# EAGLE design Adafuit_9DOF (EAGLE 6.5.0)
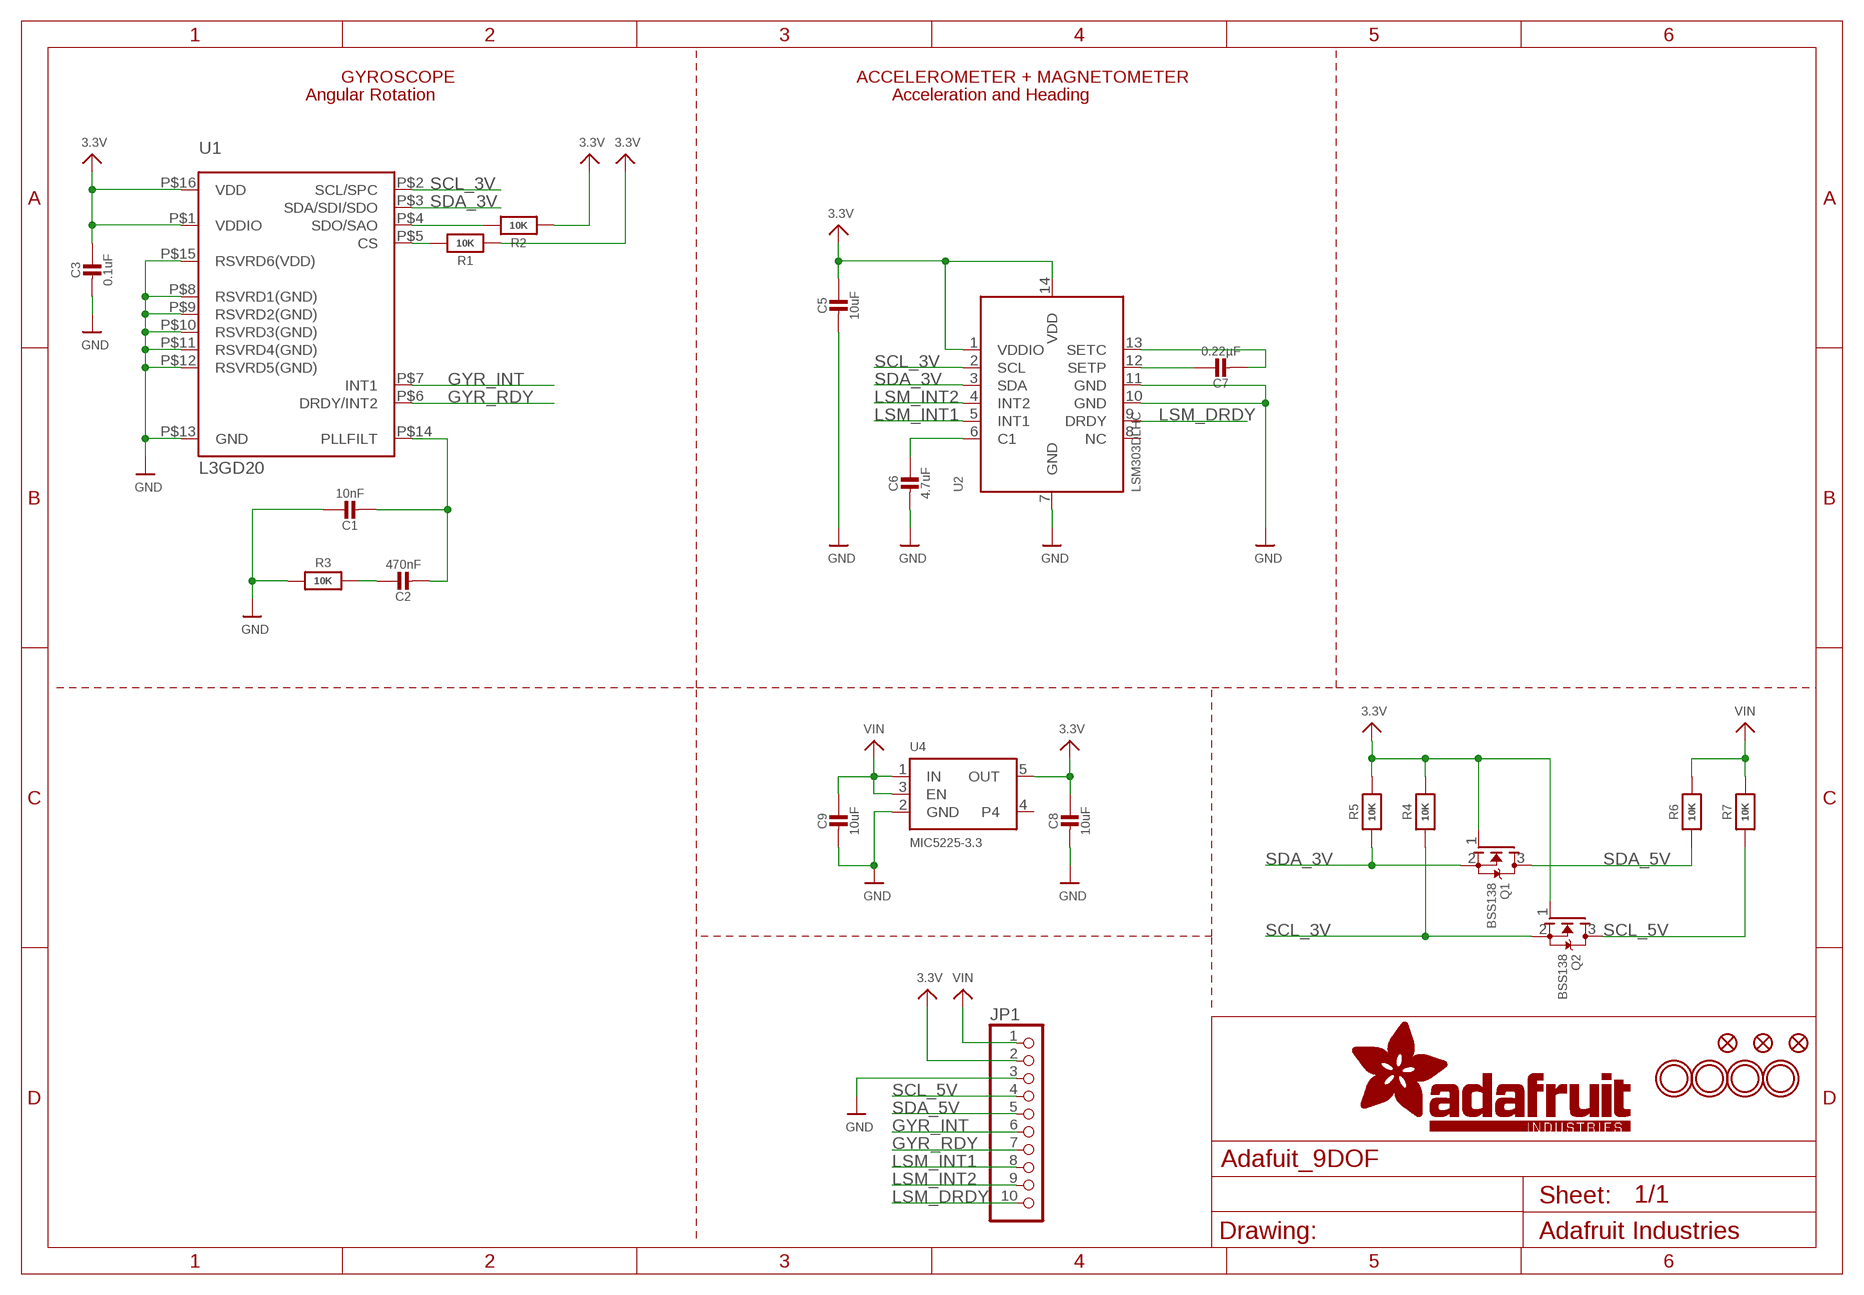
[diagram p0: schematic, sheet 1]

## Parts
C1  10nF  CAP_CERAMIC_0805MP  [_0805MP]
C2  470nF  CAP_CERAMIC_0805MP  [_0805MP]
C3  0.1uF  CAP_CERAMIC_0805MP  [_0805MP]
C5  10uF  CAP_CERAMIC_0805MP  [_0805MP]
C6  4.7uF  CAP_CERAMIC_0805MP  [_0805MP]
C7  0.22µF  CAP_CERAMIC_0805MP  [_0805MP]
C8  10uF  CAP_CERAMIC_0805MP  [_0805MP]
C9  10uF  CAP_CERAMIC_0805MP  [_0805MP]
FID1  FIDUCIAL""  [FIDUCIAL_1MM]
FID2  FIDUCIAL""  [FIDUCIAL_1MM]
FID3  FIDUCIAL""  [FIDUCIAL_1MM]
JP1  HEADER-1X10ROUND  [1X10_ROUND]
Q1  BSS138  MOSFET-NWIDE  [SOT23-WIDE]
Q2  BSS138  MOSFET-NWIDE  [SOT23-WIDE]
R1  10K  RESISTOR_0805MP  [_0805MP]
R2  10K  RESISTOR_0805MP  [_0805MP]
R3  10K  RESISTOR_0805MP  [_0805MP]
R4  10K  RESISTOR_0805MP  [_0805MP]
R5  10K  RESISTOR_0805MP  [_0805MP]
R6  10K  RESISTOR_0805MP  [_0805MP]
R7  10K  RESISTOR_0805MP  [_0805MP]
U1  L3GD20  GYRO_L3G2400D  [L3G4200D_LGA16L]
U2  LSM303DLHC  [LGA14]
U4  MIC5225-3.3  VREG_SOT23-5  [SOT23-5]
U$28  MOUNTINGHOLE2.5_THICK  [MOUNTINGHOLE_2.5_PLATED_THICK]
U$29  MOUNTINGHOLE2.5_THICK  [MOUNTINGHOLE_2.5_PLATED_THICK]
U$30  MOUNTINGHOLE2.5_THICK  [MOUNTINGHOLE_2.5_PLATED_THICK]
U$31  MOUNTINGHOLE2.5_THICK  [MOUNTINGHOLE_2.5_PLATED_THICK]

## Nets
3.3V: C3.1 C5.1 C8.1 JP1.2 Q1.1(G) Q2.1(G) R1.1 R2.1 R4.2 R5.2 U1.P$1(VDDIO) U1.P$16(VDD) U2.1(VDDIO) U2.14(VDD) U4.5(OUT)
GND: C1.1 C3.2 C5.2 C6.2 C8.2 C9.2 JP1.3 R3.1 U1.P$8(RSVRD1(GND)) U1.P$9(RSVRD2(GND)) U1.P$10(RSVRD3(GND)) U1.P$11(RSVRD4(GND)) U1.P$12(RSVRD5(GND)) U1.P$13(GND) U1.P$15(RSVRD6(VDD)) U2.7(GND) U2.10(GND) U2.11(GND) U4.2(GND)
GYR_INT: JP1.6 U1.P$7(INT1)
GYR_RDY: JP1.7 U1.P$6(DRDY/INT2)
LSM_DRDY: JP1.10 U2.9(DRDY)
LSM_INT1: JP1.8 U2.5(INT1)
LSM_INT2: JP1.9 U2.4(INT2)
N$1: R1.2 U1.P$5(CS)
N$2: R2.2 U1.P$4(SDO/SAO)
N$3: C2.1 R3.2
N$4: C1.2 C2.2 U1.P$14(PLLFILT)
N$5: C7.1 U2.12(SETP)
N$6: C6.1 U2.6(C1)
N$7: C7.2 U2.13(SETC)
SCL_3V: Q2.2(S) R4.1 U1.P$2(SCL/SPC) U2.2(SCL)
SCL_5V: JP1.4 Q2.3(D) R7.1
SDA_3V: Q1.2(S) R5.1 U1.P$3(SDA/SDI/SDO) U2.3(SDA)
SDA_5V: JP1.5 Q1.3(D) R6.1
VIN: C9.1 JP1.1 R6.2 R7.2 U4.1(IN) U4.3(EN)
Unconnected: U2.8(NC) U4.4

## Notes on the sheet
- GYROSCOPE | ACCELEROMETER + MAGNETOMETER
- Angular Rotation | Acceleration and Heading

## Library data of the parts
C1-C3 C5-C9 = microbuilder:CAP_CERAMIC: Ceramic Capacitors For new designs, use the packages preceded by an '_' character since they are more reliable: The following footprints should be used on most boards: _0402 - Standard footprint for regular board layouts _0603 - Standard footprint for regular board layouts _0805 - Standard footprint for regular board layouts _1206 - Standard footprint for regular board layouts For extremely tight-pitch boards where space is at a premium, the following 'micro-pitch' footprints can be used (smaller pads, no silkscreen outline, etc.): _0402MP - Micro-pitch footprint for very dense/compact boards _0603MP - Micro-pitch footprint for very dense/compact boards _0805MP - Micro-pitch footprint for very dense/compact boards _1206MP - Micro-pitch footprint for very dense/compact boards
FID1-FID3 = microbuilder:FIDUCIAL: Fiducial Alignment Points Various fiducial points for machine vision alignment.; BOM: EXCLUDE
JP1 = microbuilder:HEADER-1X10: PIN HEADER
Q1 Q2 = microbuilder:MOSFET-N: N-Channel Mosfet LEGEND VDS: Voltage Drain-Source ID: Drain Current RDS(ON): Drain-Source On-State Resistance VGS(TH): Gate-Source Threshold Voltage CISS: Drain-Source Input Capacitance SOT-23 Name VDS ID RDS(ON) VGS(TH) CISS Order Number 2N7002E 60V 260mA 2.5 Ohm 2.5V @ 250uA 26.7pF @ 25V 2N7002ET1GOSTR-ND BSH103 30V 850mA 400 mOhm 400mV @ 1mA 83pF @ 24V BSH103,235-ND BSS138 60V 320mA 1.6 Ohm 1.5V @ 250uA 50pF @ 10V Mouser: 771-BSS138PW115 DMN2075U-7 20V 4.2A 38 mOhm 1V @ 250 uA 594.3pF @ 10V DMN2075U-7DICT-ND * BSS138 good choice for I2C level-shifting POWERPAK 1212-8 Name VDS ID RDS(ON) VGS(TH) CISS Order Number Si7308DN 60V 6A 58 mOhm 3V @ 250uA 665pF @ 15V SI7308DN-T1-E3CT-ND
R1-R7 = microbuilder:RESISTOR: Resistors For new designs, use the packages preceded by an '_' character since they are more reliable: The following footprints should be used on most boards: _0402 - Standard footprint for regular board layouts _0603 - Standard footprint for regular board layouts _0805 - Standard footprint for regular board layouts _1206 - Standard footprint for regular board layouts For extremely tight-pitch boards where space is at a premium, the following 'micro-pitch' footprints can be used (smaller pads, no silkscreen outline, etc.): _0402MP - Micro-pitch footprint for very dense/compact boards _0603MP - Micro-pitch footprint for very dense/compact boards _0805MP - Micro-pitch footprint for very dense/compact boards _1206MP - Micro-pitch footprint for very dense/compact boards
U1 = microbuilder:GYRO_L3G2400D: L3G4200D - 3-Axis MEMS gyroscope/motion sensor Note: Same footprint works for the newer L3DG20 gyroscope Three selectable scales: 250/500/2000 dps 1²C/SPI Interface 16-bit data 8-bit temperature VDD: 2.4-3.6V (IO 1.8V compatible) -40°C-85°C
U2 = microbuilder:LSM303DLHC: LSM303DLHC 3-Axis I2C Accelerometer and 3-Axis Magnetometer VDD: 2.2-3.6V VDDIO: 1.8-VDD Magnetic Range: +/-1.3 to +/-8.1 gauss Accel Range: +/-2/4/8/16 g Temp: -40 - 85°C
U4 = microbuilder:VREG_SOT23-5: SOT23-5 Fixed Voltage Regulators Part Current Out V Out V In V Dropout θJA (°C/W) TJ (°C) Digikey Part No. ADP121 150mA 3.3V 3.4-5.5V 0.09V @ 150mA -- -- ADP121-AUJZ33R7CT-ND ADP121 150mA 3.0V 3.1-5.5V 0.09V @ 150mA -- -- ADP121-AUJZ30R7CT-ND ADP122 300mA 3.3V 3.4-5.5V 0.085V @ 300mA -- -- ADP122AUJZ-3.3-R7CT-ND ADP1712 300mA 3.3V 3.5-5.5V 0.17V @ 300mA -- -- ADP1712AUJZ-3.3-R7TR-ND AP7311 (Low Cost) 150mA 3.3V 3.5-6V 0.15V @ 150mA -- -- AP7311-33WG-7DICT-ND LD39015M18R 150mA 1.8V 1.9V-5.5V 0.08V @ 100mA -- -- 497-6977-1-ND LP2985A-33DBVR 150mA 3.3V 3.3-16V 0.28V @ 150mA 206 150 296-18479-1-ND MCP1824T-3302E/OT 300mA 3.3V 3.5V-6V 0.2V @ 300mA -- -- MCP1824T-3302E/OTCT-ND MIC5205-2.5YM5 TR 150mA 2.5V 2.7-16V 0.165V @ 150mA -- -- 576-1257-2-ND MIC5205-3.0YM5 TR 150mA 3.0V 3.2V-16V 0.165V @ 150mA -- -- 576-1258-2-ND MIC5205-3.3YM5 TR 150mA 3.3V 3.5V-16V 0.165V @ 150mA -- -- 576-1259-2-ND TPS780330220 150mA 3.3V+2.2V 3.6-5.5V 250mV Max -- -- 296-23332-1-ND TDA3663/N1,135 100mA 3.3V 3.5-45V 0.18V @ 50mA -- -- 568-5343-1-ND Max operating temp can be calculated using θJA, TJ (max junction temperature), and power in watts. Set the "Maximum Ambient Temperature" until it reaches TJ ("Max Junction Temperature"), which is the absolute limit for safe use of the regulator: Heat Sink Temperature Calculator <http://www.daycounter.com/Calculators/Heat-Sink-Temperature-Calculator.phtml> For example, With 12V source into a 3.3V LP2985 and a 30mA load, we are dissipating (12V-3.3V) * 0.03A = 0.261W. With a θJA of 206 °C/W, a TJ of 150°C, and 261mW we can safely use the chip without a heat sink up to 75°C (=147.1°C Junction Temperature).
U$28-U$31 = microbuilder:MOUNTINGHOLE: Mounting Hole For #2 screws (0.086"/2.18mm width, 0.094"/2.4mm hole) use 2.5mm; BOM: EXCLUDE

## Board
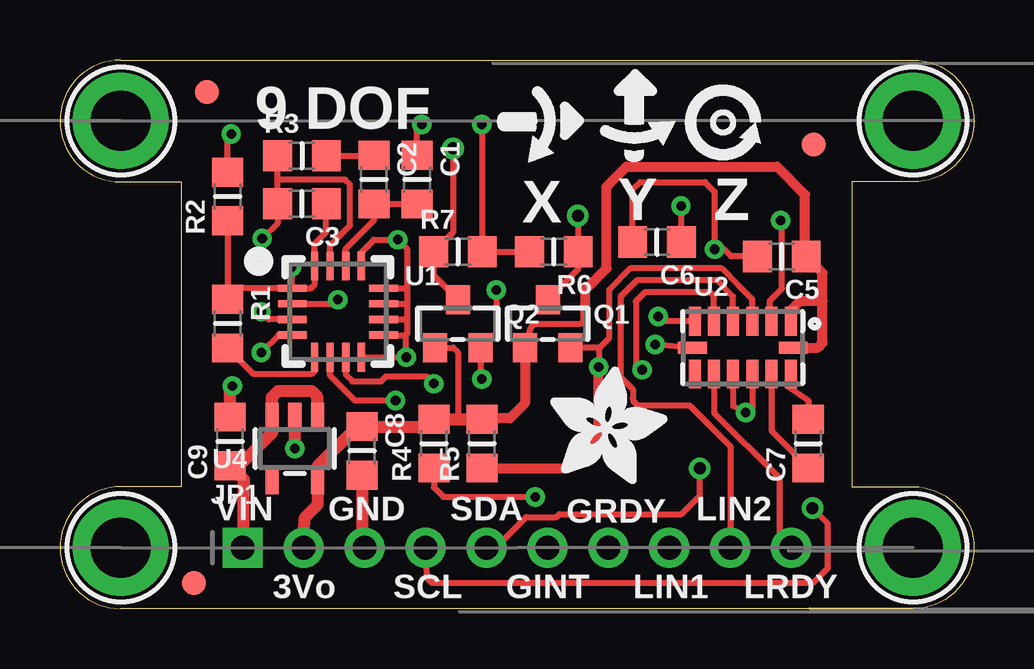
[diagram p1: board, top side]
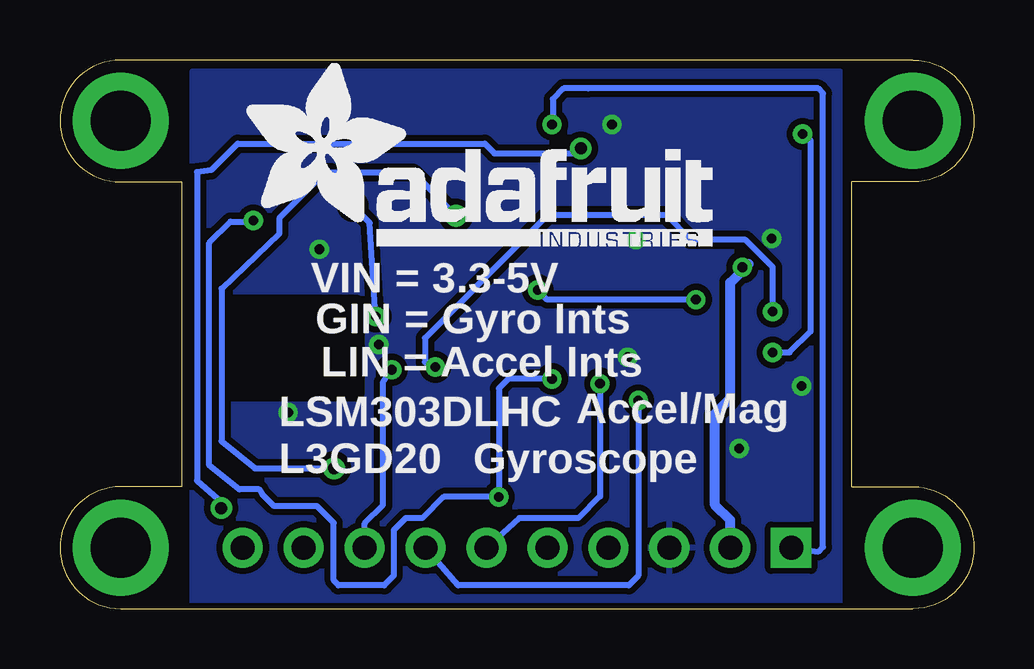
[diagram p2: board, bottom side, seen from below]

Size 38.1 x 22.86 mm. Coordinates in mm from the lower left corner, seen from the top.
Outline: 5.08,5.08 5.08,17.78 2.54,17.78 arc-90 0,20.32 arc-90 2.54,22.86 35.56,22.86 arc-90 38.1,20.32 arc-90 35.56,17.78 33.02,17.78 33.02,5.08 35.56,5.08 arc-90 38.1,2.54 arc-90 35.56,0 2.54,0 arc-90 0,2.54 arc-90 2.54,5.08 5.08,5.08
Copper layers (1*16): Top 0.035mm / dielectric 1.5mm / Bottom 0.035mm
Design rules "adafruit": minimum track width 8mil, minimum drill 15.5mil, track to track 8mil, track to pad 8mil, pad to pad 8mil, via to via 8mil, smd to smd 8mil, copper to edge 10mil, drill to drill 8mil, minimum pad ring 10mil, minimum via ring 8mil, stop-mask expansion 4mil, vias tented up to drill 20mil, thermal gap 10mil
bRestrict: area 25.8,9 to 31,12.7

### Footprints (pad centres in the part's own frame; a part is rotated, then mirrored left to right if it is on the bottom)
_0805MP = smd 1.2 x 1.3: 1 -1.016,0; 2 1.016,0
FIDUCIAL_1MM = smd 1 x 1: 1 0,0
1X10_ROUND = drill 1 pad 1.676 square: 1 -11.43,0 | drill 1 pad 1.676: 2 -8.89,0; 3 -6.35,0; 4 -3.81,0; 5 -1.27,0; 6 1.27,0; 7 3.81,0; 8 6.35,0; 9 8.89,0; 10 11.43,0
SOT23-WIDE = smd 1 x 1.2: 1 -0.95,-1; 2 0.95,-1; 3 0,1
L3G4200D_LGA16L = smd 1.2 x 0.3: P$1 -1.9,0.975; P$2 -1.9,0.325; P$3 -1.9,-0.325; P$4 -1.9,-0.975; P$9 1.9,-0.975; P$10 1.9,-0.325; P$11 1.9,0.325; P$12 1.9,0.975 | smd 0.3 x 1.2: P$5 -0.975,-1.9; P$6 -0.325,-1.9; P$7 0.325,-1.9; P$8 0.975,-1.9; P$13 0.975,1.9; P$14 0.325,1.9; P$15 -0.325,1.9; P$16 -0.975,1.9
LGA14 = smd 0.5 x 1.2: 1 2,1.1; 2 1.2,1.1; 3 0.4,1.1; 4 -0.4,1.1; 5 -1.2,1.1; 6 -2,1.1; 8 -2,-1.1; 9 -1.2,-1.1; 10 -0.4,-1.1; 11 0.4,-1.1; 12 1.2,-1.1; 13 2,-1.1 | smd 1.2 x 0.5: 7 -2.1,0; 14 2.1,0
SOT23-5 = smd 0.55 x 1.2: 1 -0.95,-1.3; 2 0,-1.3; 3 0.95,-1.3; 4 0.95,1.3; 5 -0.95,1.3
MOUNTINGHOLE_2.5_PLATED_THICK = drill 2.5 pad 4: P$1 0,0

### Placement (x,y rotation side)
C1  14.89,17.87 270 top
C2  13.09,17.87 270 top
C3  10.09,16.87 180 top
C5  30.09,14.67 180 top
C6  24.89,15.27 180 top
C7  31.19,6.87 90 top
C8  12.59,6.57 270 top
C9  7.09,6.97 90 top
FID1  31.42,19.33 0 top
FID2  5.59,1.07 0 top
FID3  6.12,21.52 0 top
JP1  19.05,2.54 0 top
Q1  20.33,11.87 0 top
Q2  16.59,11.87 0 top
R1  6.99,11.87 270 top
R2  6.99,17.17 90 top
R3  10.09,18.87 0 top
R4  15.59,6.87 90 top
R5  17.59,6.87 90 top
R6  20.59,14.87 180 top
R7  16.59,14.87 0 top
U1  11.59,12.37 0 top
U2  28.46,10.87 0 top
U4  9.79,6.67 180 top
U$8  [ADAFRUIT_5MM]  20.45,5.21 0 top
U$25  [SYMBOL_GYROXYZ_10MM]  18.99,18.57 0 top
U$26  [ADAFRUIT_TEXT_20MM]  30.48,15.11 0 bottom
U$28  35.56,2.54 0 top
U$29  35.56,20.32 0 top
U$30  2.54,20.32 0 top
U$31  2.54,2.54 0 top

### Tracks (layer width: path | path; a pad name or v marks a point on that pad's centre or on a via)
3.3V  (via drill 0.4)
  Top 0.25: C3.1 11.09,16.56 11.09,15.67 10.61,15.2 U1.P$16 10.61,13.5 10.46,13.35 U1.P$1 7.45,13.35 R1.1 | Q2.1 16.39,10.87 16.59,10.67 16.59,7.89 | Q1.1 19.64,11.72 19.79,11.87 21.71,11.87 21.91,11.95 | 31.06,14.68 C5.1 | 7.19,13.09 R1.1 | R2.1 R1.1
  Top 0.254: v9.65,14.22 9.65,13.38 U1.P$1
  Top 0.406: U2.14 31.59,10.87 31.79,11.07 31.79,12.83 | 31.79,12.83 31.79,13.99 C5.1 | 21.91,11.95 21.91,13.29 22.79,14.17 22.79,17.58 23.62,18.41 29.9,18.41 31.06,17.25 31.06,14.68 | U2.1 30.46,12.43 30.86,12.83 31.79,12.83 | Q1.1 19.38,8.56 18.75,7.93 17.63,7.93 R5.2
  Top 0.5: R5.2 16.59,7.89 R4.2 15.29,7.59 C8.1 12.4,7.59 10.74,5.92 U4.5 10.74,4.32 10.2,3.78 JP1.2
  Bottom 0.406: JP1.2 10.16,3.68 10.79,4.32 10.79,8.13 10.16,8.76 10.16,13.59 9.4,14.35 v9.65,14.22
GND  (via drill 0.4)
  Top 0.25: U2.7 v24.81,11 | U2.10 28.06,8.45 v28.59,8.17 28.86,8.32 U2.11 | U1.P$9 14.41,11.4 | 14.41,11.4 14.49,11.47 14.49,12.07 | 14.49,12.07 14.49,12.77 | 14.49,12.77 14.49,13.37 | 14.49,13.37 14.49,14.97 v14.09,15.37 13.09,15.37 12.56,14.85 U1.P$13 | U1.P$12 14.46,13.35 14.49,13.37 | U1.P$11 14.41,12.7 14.49,12.77 | U1.P$10 14.46,12.05 14.49,12.07 | C5.2 27.99,14.67 27.69,14.97 v27.29,14.97 27.29,17.37 26.89,17.77 24.19,17.77 23.87,17.46 C6.2 | v8.43,15.43 9.07,16.05 C3.2 9.07,17.87 | 9.07,17.87 R3.1 | U1.P$15 11.26,15.15 12.09,15.97 12.09,17.67 11.89,17.87 9.07,17.87 | C1.1 14.89,19.97 v15.09,20.17 | U1.P$8 v14.44,10.47 14.41,10.5 14.41,11.4
  Top 0.5: C8.2 12.59,2.52 JP1.3 | U4.2 v9.79,6.67 | C9.2 7.09,9.17 v7.19,9.27
  Bottom 0.25: v27.29,14.97 26.99,14.97 | v8.43,15.43 8.5,15.4
  pour Bottom (isolate 0.254): 5.59,22.37 32.59,22.37 32.59,-0.13 5.59,-0.13
GYR_INT  (via drill 0.4)
  Top 0.25: U1.P$7 11.91,9.75 12.19,9.47 13.39,9.47 13.59,9.67 15.29,9.67 v15.59,9.37
  Bottom 0.25: v15.59,9.37 15.59,4.67 16.49,3.77 18.96,3.77 JP1.6
GYR_RDY  (via drill 0.4)
  Top 0.25: 11.26,9.7 12.29,8.67 v13.99,8.67
  Top 0.254: 11.26,9.7 U1.P$6
  Bottom 0.25: v13.99,8.67 13.99,1.37 14.39,0.97 21.5,0.97 JP1.7
LSM_DRDY
  Top 0.25: 30.49,2.4 JP1.10 29.99,2.9 29.99,2.97
  Top 0.254: U2.9 27.26,8.17 29.99,5.44 29.99,2.97
LSM_INT1  (via drill 0.4)
  Top 0.25: U2.5 27.26,13.03 27.12,13.17 24.38,13.17 24.01,12.8 24.01,10.12 24.17,10.08 v24.27,9.95
  Bottom 0.254: JP1.8 25.4,3.56 24.64,4.32 24.64,9.43 v24.27,9.95
LSM_INT2
  Top 0.25: U2.4 28.06,13 27.39,13.67 24.05,13.67 23.37,12.99 23.37,9.65 23.88,9.14 23.88,8.76 23.89,8.66 24.08,8.47 26.23,8.47
  Top 0.254: 26.23,8.47 27.94,6.77 JP1.9
N$1
  Top 0.25: U1.P$5 10.61,9.9 10.49,9.77 8.07,9.77 R1.2
N$2  (via drill 0.4)
  Top 0.25: U1.P$4 9.11,11.4 v8.39,10.67 | R2.2 6.99,19.62 v7.14,19.77
  Bottom 0.25: v8.39,10.67 7.69,10.67 6.81,11.55 6.81,19.5 v7.14,19.77
N$3
  Top 0.25: R3.2 13.07,18.87 C2.1
N$4
  Top 0.25: U1.P$14 11.91,15 13.09,16.17 C2.2 C1.2
N$5
  Top 0.25: U2.12 29.66,7.42 30.06,7.02 31.17,5.87 C7.1
N$6  (via drill 0.4)
  Top 0.25: U2.6 25.13,11.97 v24.93,12.17 | v25.89,16.77 25.89,15.29 C6.1
  Bottom 0.25: v24.93,12.17 25.19,16.07 v25.89,16.77
N$7
  Top 0.25: U2.13 30.33,9.27 31.19,8.67 C7.2
SCL_3V  (via drill 0.4)
  Top 0.25: U2.2 29.59,12.19 29.59,12.83 30.1,13.33 30.1,16.11 v30.04,16.17 | U1.P$2 11.41,12.7 v11.59,12.87 | v18.19,13.27 18.19,11.52 Q2.2 17.54,9.62 v17.59,9.57 | R4.1 15.59,5.05 15.99,4.65 v19.81,4.65
  Bottom 0.25: 29.79,4.97 29.65,4.75 29.17,4.27 27.39,4.27 26.69,3.57 26.69,1.17 26.49,0.97 24.59,0.97 24.19,1.37 24.19,3.27 23.69,3.77 22.99,3.77 22.11,4.65 v19.81,4.65 19.81,9.17 19.41,9.57 v17.59,9.57 | v11.59,12.87 17.79,12.87 v18.19,13.27
  Bottom 0.254: 29.79,4.97 30.63,4.97 31.88,5.97 31.88,15.24 30.99,16.13 30,16.13 v30.04,16.17
SCL_5V  (via drill 0.5)
  Top 0.25: Q2.3 15.57,13.89 R7.1 16.39,15.69 v16.39,19.17 | JP1.4 15.28,1.29 15.49,1.08 31.41,1.08 32.01,1.68 32.01,3.55 v31.37,4.19
  Bottom 0.25: 31.79,18.27 30.69,19.37 20.39,19.37 19.99,18.97 16.59,18.97 v16.39,19.17
  Bottom 0.254: 31.79,18.27 32.39,18.18 32.39,5.33 31.37,4.45 v31.37,4.19
SDA_3V  (via drill 0.4)
  Top 0.25: U2.3 28.86,12.89 28.66,13.09 28.29,13.47 27.59,14.17 23.79,14.17 22.89,13.27 22.89,11.27 22.49,10.87 Q1.2 | U1.P$3 8.71,12.05 v8.39,12.37
  Top 0.254: v22.45,10.07 22.49,10.16 22.49,10.87
  Top 0.406: R5.1 21.18,5.86 22.45,7.13 v22.45,10.07
  Bottom 0.254: v8.39,12.37 8.39,14.23 9.53,15.37 11.81,15.37 12.83,16.38 17.78,16.38 18.67,15.49 18.79,15.37 22.89,11.27 22.89,10.27 v22.45,10.07
SDA_5V  (via drill 0.5)
  Top 0.25: Q1.3 21.6,14.14 R6.1 21.59,14.89 v21.59,16.37
  Top 0.254: JP1.5 18.16,2.54 19.43,3.81 20.7,3.81 20.83,3.94 25.91,3.94 26.67,4.7 v26.67,5.84
  Bottom 0.25: 26.8,18.17 23.39,18.17 v21.59,16.37
  Bottom 0.254: 26.8,18.17 27.04,18.17 28.96,16.26 28.96,15.62 31.37,13.33 31.37,6.98 29.97,5.84 v26.67,5.84
VIN  (via drill 0.4)
  Top 0.25: R7.2 R6.2 19.59,14.89
  Top 0.254: v17.59,20.17 17.59,14.89 R7.2
  Top 0.5: U4.1 10.74,8.82 10.49,9.07 9.09,9.07 8.84,8.82 U4.3 8.84,7.32 7.47,5.96 C9.1 7.66,5.39 JP1.1
  Bottom 0.25: JP1.1 6.49,2.37 6.29,2.57 6.29,21.47 6.49,21.67 16.09,21.67
  Bottom 0.254: 16.09,21.67 17.11,21.67 17.55,21.23 17.55,20.21 v17.59,20.17

### Text on the board
tPlace: 9 DOF | X | Y | Z | VIN | GND | SDA | GRDY | LIN2 | 3Vo | SCL | GINT | LIN1 | LRDY
bPlace: VIN = 3.3-5V | GIN = Gyro Ints | LIN = Accel Ints | Accel/Mag | LSM303DLHC | Gyroscope | L3GD20